# Altium schematic sheet Reefing-Overview.SchDoc: Reefing System
size A4; DocumentNumber: Overview; Revision: V1.0; SheetNumber: 1; SheetTotal: 13; Author: Luca Jost; Subtitle: Overview
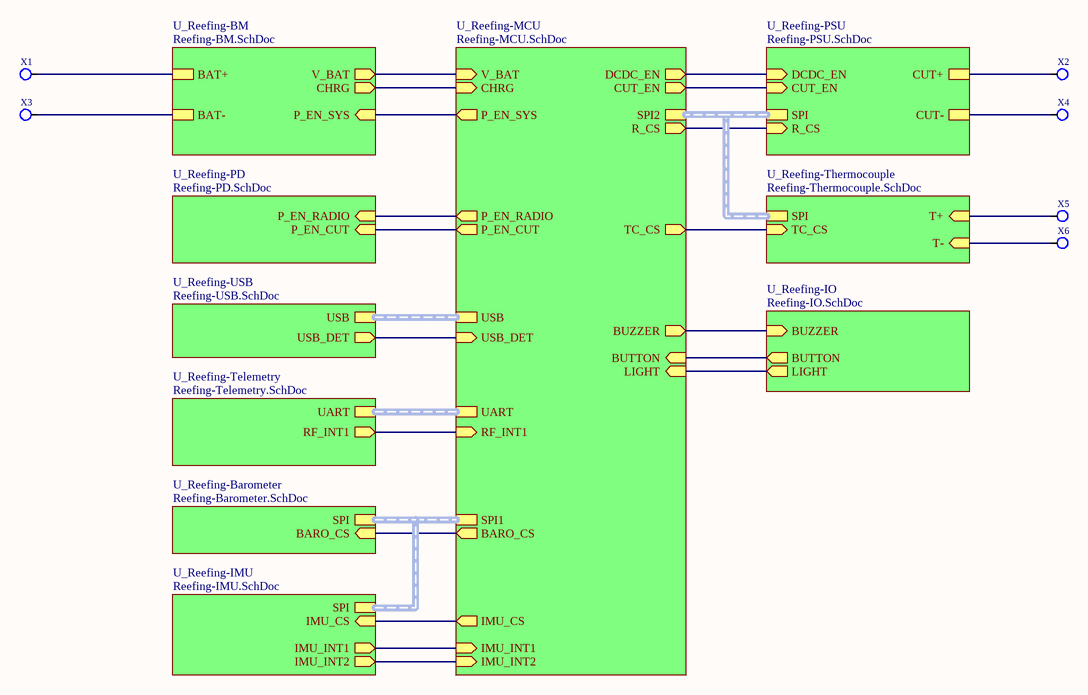
[diagram p0: Reefing-Overview.SchDoc]

## Parts
X1  Solder Pad  [SMD Solderpad 2.5x1.8]  (value not drawn)  (no BOM)
X2  Solder Pad  [SMD Solderpad 2.5x1.8]  (value not drawn)  (no BOM)
X3  Solder Pad  [SMD Solderpad 2.5x1.8]  (value not drawn)  (no BOM)
X4  Solder Pad  [SMD Solderpad 2.5x1.8]  (value not drawn)  (no BOM)
X5  Solder Pad  [SMD Solderpad 2.5x1.8]  (value not drawn)  (no BOM)
X6  Solder Pad  [SMD Solderpad 2.5x1.8]  (value not drawn)  (no BOM)

## Sub-sheets
U_Reefing-Barometer = Reefing-Barometer.SchDoc: SPI (harness SPI), BARO_CS (in)
U_Reefing-BM = Reefing-BM.SchDoc: CHRG (out), V_BAT (out), P_EN_SYS (in), BAT+, BAT-
U_Reefing-IMU = Reefing-IMU.SchDoc: SPI (harness SPI), IMU_CS (in), IMU_INT1 (out), IMU_INT2 (out)
U_Reefing-IO = Reefing-IO.SchDoc: LIGHT (out), BUZZER (in), BUTTON (out)
U_Reefing-MCU = Reefing-MCU.SchDoc: V_BAT (in), CHRG (in), P_EN_SYS (out), P_EN_RADIO (out), P_EN_CUT (out), USB_DET (in), TC_CS (out), R_CS (out), CUT_EN (out), DCDC_EN (out), BUZZER (out), BUTTON (in), LIGHT (in), UART, RF_INT1 (in), BARO_CS (out), IMU_CS (out), IMU_INT1 (in), IMU_INT2 (in), SPI1, SPI2, USB
U_Reefing-PD = Reefing-PD.SchDoc: P_EN_RADIO (in), P_EN_CUT (in)
U_Reefing-PSU = Reefing-PSU.SchDoc: DCDC_EN (in), SPI (harness SPI), CUT+, R_CS (in), CUT_EN (in), CUT-
U_Reefing-Telemetry = Reefing-Telemetry.SchDoc: UART, RF_INT1 (out)
U_Reefing-Thermocouple = Reefing-Thermocouple.SchDoc: SPI (harness SPI), TC_CS (in), T+ (in), T- (in)
U_Reefing-USB = Reefing-USB.SchDoc: USB (harness USB), USB_DET (out)

## Nets
NetX1_1: X1.1 ; sheet U_Reefing-BM/BAT+
NetX2_1: X2.1 ; sheet U_Reefing-PSU/CUT+
NetX3_1: X3.1 ; sheet U_Reefing-BM/BAT-
NetX4_1: X4.1 ; sheet U_Reefing-PSU/CUT-
NetX5_1: X5.1 ; sheet U_Reefing-Thermocouple/T+
NetX6_1: X6.1 ; sheet U_Reefing-Thermocouple/T-
(unnamed): sheet U_Reefing-BM/CHRG, sheet U_Reefing-MCU/CHRG
(unnamed): sheet U_Reefing-BM/V_BAT, sheet U_Reefing-MCU/V_BAT
(unnamed): sheet U_Reefing-BM/P_EN_SYS, sheet U_Reefing-MCU/P_EN_SYS
(unnamed): sheet U_Reefing-PD/P_EN_RADIO, sheet U_Reefing-MCU/P_EN_RADIO
(unnamed): sheet U_Reefing-PD/P_EN_CUT, sheet U_Reefing-MCU/P_EN_CUT
(unnamed): sheet U_Reefing-Barometer/BARO_CS, sheet U_Reefing-MCU/BARO_CS
(unnamed): sheet U_Reefing-PSU/DCDC_EN, sheet U_Reefing-MCU/DCDC_EN
(unnamed): sheet U_Reefing-PSU/R_CS, sheet U_Reefing-MCU/R_CS
(unnamed): sheet U_Reefing-PSU/CUT_EN, sheet U_Reefing-MCU/CUT_EN
(unnamed): sheet U_Reefing-Telemetry/RF_INT1, sheet U_Reefing-MCU/RF_INT1
(unnamed): sheet U_Reefing-Thermocouple/TC_CS, sheet U_Reefing-MCU/TC_CS
(unnamed): sheet U_Reefing-USB/USB_DET, sheet U_Reefing-MCU/USB_DET
(unnamed): sheet U_Reefing-IO/LIGHT, sheet U_Reefing-MCU/LIGHT
(unnamed): sheet U_Reefing-IO/BUZZER, sheet U_Reefing-MCU/BUZZER
(unnamed): sheet U_Reefing-IO/BUTTON, sheet U_Reefing-MCU/BUTTON
(unnamed): sheet U_Reefing-MCU/IMU_CS, sheet U_Reefing-IMU/IMU_CS
(unnamed): sheet U_Reefing-MCU/IMU_INT1, sheet U_Reefing-IMU/IMU_INT1
(unnamed): sheet U_Reefing-MCU/IMU_INT2, sheet U_Reefing-IMU/IMU_INT2

## Buses and harness runs
harness sheet U_Reefing-Barometer/SPI = sheet U_Reefing-IMU/SPI = sheet U_Reefing-MCU/SPI1
harness sheet U_Reefing-MCU/SPI2 = sheet U_Reefing-PSU/SPI = sheet U_Reefing-Thermocouple/SPI
harness sheet U_Reefing-MCU/UART = sheet U_Reefing-Telemetry/UART
harness sheet U_Reefing-MCU/USB = sheet U_Reefing-USB/USB

## Notes on the sheet
- Title
- Author:
- Subtitle
- Date:
- Rev:
- File:
- Sheet
- of

## Library data of the parts
X1-X6 = X-PAD-MEDIUM: Medium SMD Pad; Unit Price: 0.00